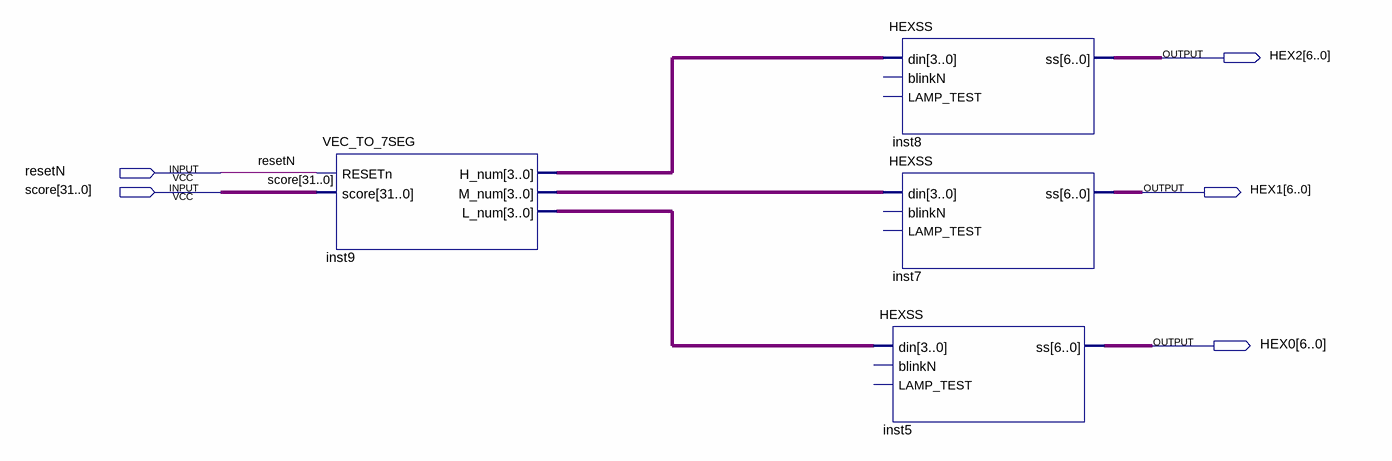
[diagram p0: schematic sheet]
// Quartus schematic score_top.bdf as structural Verilog: 4 symbols, 5 pins
module score_top (
  input  resetN,
  input  [31:0] score,
  output [6:0] HEX2,
  output [6:0] HEX1,
  output [6:0] HEX0
);

  wire [3:0] inst9_h_num, inst9_l_num, inst9_m_num;

  VEC_TO_7SEG inst9 (.RESETn(resetN), .score(score), .H_num(inst9_h_num), .M_num(inst9_m_num), .L_num(inst9_l_num));
  HEXSS inst8 (.din(inst9_h_num), .ss(HEX2));  // open: blinkN, LAMP_TEST
  HEXSS inst7 (.din(inst9_m_num), .ss(HEX1));  // open: blinkN, LAMP_TEST
  HEXSS inst5 (.din(inst9_l_num), .ss(HEX0));  // open: blinkN, LAMP_TEST
endmodule
